# Altium project Farag_32U4_v1.1.PrjPcb
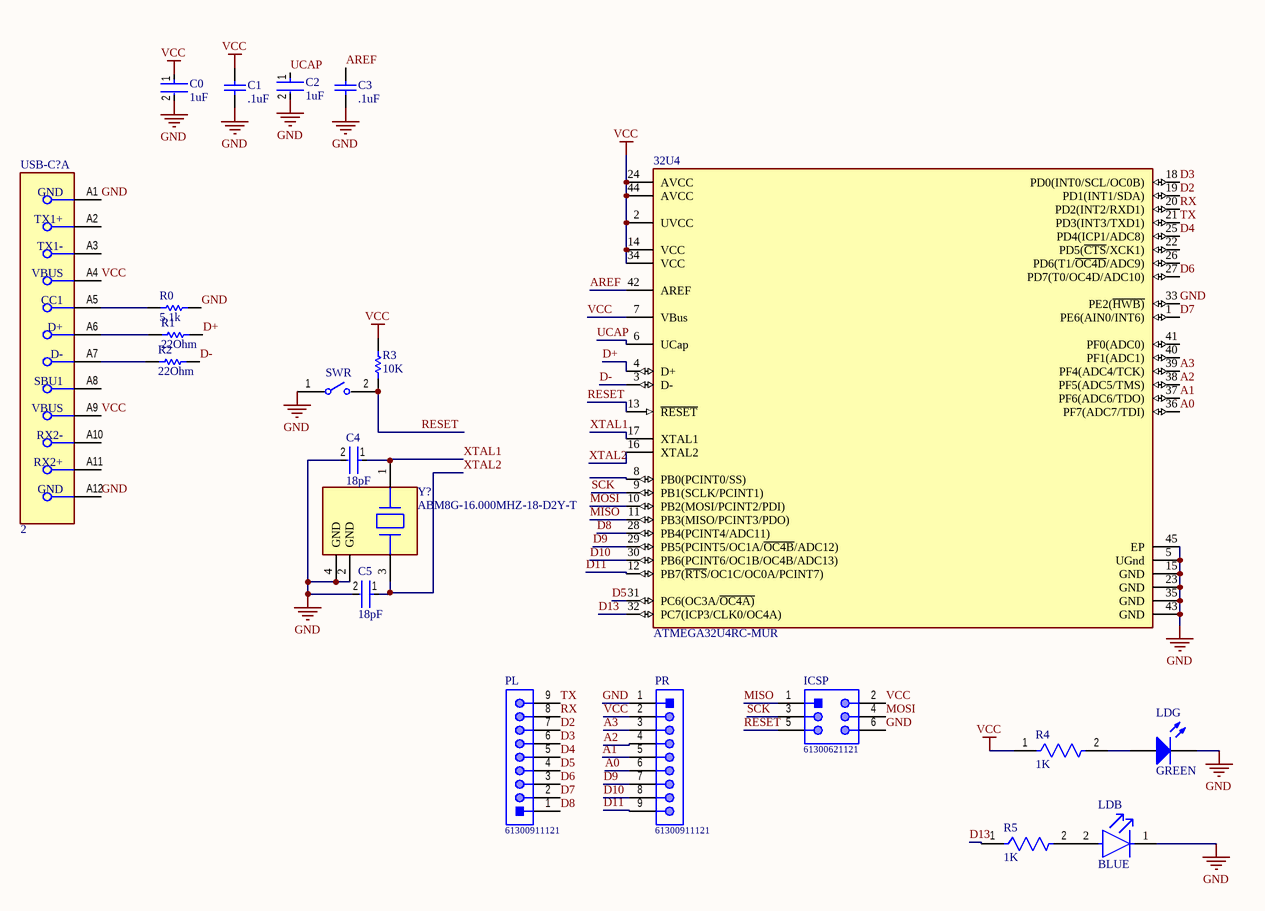
[diagram p0: Sheet1.SchDoc]
CAGE_CODE: ?????; CONTRACT_NUMBER: <CONTRACT NO>; DOC_NO_ASSY_DWG: <ASSY DWG NO>; DOC_NO_BOM: <BOM DOC NO>; DOC_NO_FAB_DWG: <FAB DWG NO>; DOC_NO_SCH_DWG: <SCH DWG NO>; PCB_2_DEC_TOL: +/-.01; PCB_3_DEC_TOL: +/-.010; PCB_ANG_TOL: +/-1/2; PCB_ASSEMBLY_NO: <PCB ASSY NO>; PCB_CHECKER: - -----; PCB_CHECKER_APP_DATE: --/--/----; PCB_DESIGNER: - -----; PCB_DESIGNER_APP_DATE: --/--/----; PCB_DWG_NO: <PCB DWG NO>; PCB_ENGINEER: - -----; PCB_ENGINEER_APP_DATE: --/--/----; PCB_PART_NUMBER: <PCB PN>; PCB_REV: A; SCH_REV: A
1 sheet, 21 parts. Net scope: global (net labels, ports and power ports of the same name join across sheets).
Board file: PCB1.PcbDoc

## Sheet Sheet1.SchDoc
size 431 x 279 mm; SheetNumber: 1; SheetTotal: 1; ENG_APP_DATE: --/--/--; DSN_APP_DATE: --/--/--; CHK_APP_DATE: --/--/--

### Parts
2  2  [FP-1054500101-MFG]  (part A of 3)
32U4  ATMEGA32U4RC-MUR  [FP-44PW-IPC_A]
C0  1uF  [FP-CC0805-EB-MFG]
C1  .1uF  [CAPC2013X145X50LL20T25]
C2  1uF  [FP-CC0805-EB-MFG]
C3  .1uF  [CAPC2013X145X50LL20T25]
C4  18pF  [FP-C0805C-DN-MFG]
C5  18pF  [FP-C0805C-DN-MFG]
ICSP  61300621121  [61300621121]
LDB  BLUE
LDG  GREEN  [0805_A]
PL  61300911121  [61300911121]
PR  61300911121  [61300911121]
R0  5.1k  [RESC2013X60X30NL20T20]
R1  22Ohm  [RESC2013X60X30ML20T20]
R2  22Ohm  [RESC2013X60X30ML20T20]
R3  10K  [RESC2013X60X30LL20T20]
R4  1K  [FP-RNCP0805-MFG]
R5  1K  [FP-RNCP0805-MFG]
SWR  (no value)  [FP-B3U-1000P-MFG]
Y1  ABM8G-16.000MHZ-18-D2Y-T  [FP-ABM8G-MFG]

### Nets
GND: 2.A1(GND) 2.A12(GND) 32U4.5(UGnd) 32U4.15(GND) 32U4.23(GND) 32U4.33(PE2(~{HWB)}) 32U4.35(GND) 32U4.43(GND) 32U4.45(EP) C0.2 C1.2 C2.2 C3.2 C4.2 C5.2 ICSP.6 LDB.1(C) LDG.1(K) PR.1 R0.2 SWR.1 Y1.2(GND) Y1.4(GND)
VCC: 2.A4(VBUS) 2.A9(VBUS) 32U4.2(UVCC) 32U4.7(VBus) 32U4.14(VCC) 32U4.24(AVCC) 32U4.34(VCC) 32U4.44(AVCC) C0.1 C1.1 ICSP.2 PR.2 R3.1 R4.1
A0: 32U4.36(PF7(ADC7/TDI)) PR.6
A1: 32U4.37(PF6(ADC6/TDO)) PR.5
A2: 32U4.38(PF5(ADC5/TMS)) PR.4
A3: 32U4.39(PF4(ADC4/TCK)) PR.3
AREF: 32U4.42(AREF) C3.1
D2: 32U4.19(PD1(INT1/SDA)) PL.7
D3: 32U4.18(PD0(INT0/SCL/OC0B)) PL.6
D4: 32U4.25(PD4(ICP1/ADC8)) PL.5
D5: 32U4.31(PC6(OC3A/~{OC4A)}) PL.4
D6: 32U4.27(PD7(T0/OC4D/ADC10)) PL.3
D7: 32U4.1(PE6(AIN0/INT6)) PL.2
D8: 32U4.28(PB4(PCINT4/ADC11)) PL.1
D9: 32U4.29(PB5(PCINT5/OC1A/~{OC4B}/ADC12)) PR.7
D10: 32U4.30(PB6(PCINT6/OC1B/OC4B/ADC13)) PR.8
D11: 32U4.12(PB7(~{RTS}/OC1C/OC0A/PCINT7)) PR.9
D13: 32U4.32(PC7(ICP3/CLK0/OC4A)) R5.1
D+: 32U4.4(D+) R1.2
D-: 32U4.3(D-) R2.2
MISO: 32U4.11(PB3(MISO/PCINT3/PDO)) ICSP.1
MOSI: 32U4.10(PB2(MOSI/PCINT2/PDI)) ICSP.4
RESET: 32U4.13(~{RESET}) ICSP.5 R3.2 SWR.2
RX: 32U4.20(PD2(INT2/RXD1)) PL.8
SCK: 32U4.9(PB1(SCLK/PCINT1)) ICSP.3
TX: 32U4.21(PD3(INT3/TXD1)) PL.9
UCAP: 32U4.6(UCap) C2.1
XTAL1: 32U4.17(XTAL1) C4.1 Y1.1
XTAL2: 32U4.16(XTAL2) C5.1 Y1.3
Net2_A5: 2.A5(CC1) R0.1
Net2_A6: 2.A6(D+) R1.1
Net2_A7: 2.A7(D-) R2.1
NetLDB_2: LDB.2(A) R5.2
NetLDG_2: LDG.2(A) R4.2

Not connected (* = marked no-connect by the designer): 2 A2(TX1+) A3(TX1-) A8(SBU1) A10(RX2-) A11(RX2+); 32U4 8(PB0(PCINT0/SS)) 22(PD5(~{CTS}/XCK1)) 26(PD6(T1/~{OC4D}/ADC9)) 40(PF1(ADC1)) 41(PF0(ADC0))

### Library data of the parts
2 = CMP-04767-000004-1: CONN RCP USB3.1 TYPEC 24P SMD RA; Manufacturer: Molex; Manufacturer Part Number: 1054500101; Number Of Contacts: 24; Voltage Rating: 30V; Shielding: true; Is Female: yes; Current Rating: 0.25/1.25/5A; Pitch: 0.5mm; Conn Orientation: Right Angle
32U4 = CMP-06276-000241-1: IC MCU 8BIT 32KB FLASH 44VQFN; Core Architecture: AVR; Frequency: 16MHz; Oscillator Type: Internal; Interface: I2C; Peripherals: Brown-out Detect/Reset; Number of I/Os: 26; Packaging: Tape and Reel; Max Operating Temperature: 85°C; Min Operating Temperature: -40°C; Memory Type: FLASH; Case/Package: VQFN; Memory Size: 32KB; RoHS Compliant: Yes
C0 C2 = CMP-03422-000665-2: CAP CER 1UF 6.3V X7R 0805 - CC0805KKX7R5BB105; Tolerance: 10%; Capacitance: 1uF; Weight: 0.000194oz; Width: 0.049inch; Thickness: 0.057inch; Dielectric: X7R; Termination: SMD/SMT; Packaging: Tape and Reel; RoHS Compliant: Yes; Length: 2mm; Halogen Free: Halogen Free; Voltage Rating: 6.3V; Height: 1.25mm; Max Operating Temperature: 125°C; Depth: 1.25mm; Construction: Flat; Case Code (Metric): 2012; Series: CC; Case/Package: 0805; Resistor Type: Ceramic; Case Code (Imperial): 0805; Min Operating Temperature: -55°C; Voltage Rating (DC): 6.3V; Lead Free: Lead Free; Mount: Surface Mount; Radiation Hardening: No
C1 C3 = CMP-1036-04391-2: C0805C104K9RACTU; Manufacturer: Kemet; Part Number: C0805C104K9RACTU
C4 C5 = CMP-1036-01146-3: CAP CER 18PF 50V 10% NP0 0805 - C0805C180K5GACTU; Manufacturer: KEMET; Tolerance: 0.1; Material: Ceramic; Temperature Coefficient: 30ppm/°C; Temperature Characteristic: C0G; Mouser Description: Multilayer Ceramic Capacitors MLCC - SMD/SMT 50volts 18pF C0G 10%; Category: Cap; Automotive: No; Device Class L1: Passive Components; Height: 0.88mm; RoHS: TRUE; Manufacturer Part Number: C0805C180K5GACTU; Octopart: https://octopart.com/c0805c180k5gactu-kemet-6728804; Ipc Land Pattern Name: CAPC200125X78; Voltage Rating: 50 V; ComponentLink2URL: https://content.kemet.com/datasheets/KEM_C1003_C0G_SMD.pdf; ComponentLink2Description: Datasheet; Value: 18 pF; Temperature Range Low: -55°C; Digikey Description: CAP CER 18PF 50V 10% NP0 0805; Lead Free: Yes; Temperature Range High: +125°C; Device Class L2: Capacitors; Device Class L3: Ceramic Capacitors; Temperature: -55°C to +125°C; Capacitance: 18 pF; Package: C0805C-DN
ICSP = CMP-1502-01072-1: THT Vertical Pin Header WR-PHD, Pitch 2.54 mm, Dual Row, 6 pins; Manufacturer: Wurth Elektronik; Contact Resistance: 20mOhm; Withstanding Voltage: 500VAC; Pin Number: 6; Gender: Male; Pitch: 2.54mm; Working Voltage: 250VAC; Rated Current: 3A; Packaging: Bag; Row Number: Dual; Manufacturer URL: http://www.we-online.de; Part Number: 61300621121; Operating Temperature: -40to105degC; Mounting Technology: THT; Package Reference: 61300621121; Datasheet URL: https://katalog.we-online.de/em/datasheet/6130xx21121.pdf; Orientation: Vertical; Publisher: WurthElektronik
LDB = CMP-1426-00008-2: LED BLUE CLEAR 0805 SMD - 150080BS75000; Test Current: 20mA; Dominant Wavelength: 470nm; Forward Voltage: 3.2V; Forward Current: 30mA; Lens Size: 1.25mm; Luminous Intensity: 145mcd; Lens Color: Colorless; Viewing Angle: 140°; Case Code (Imperial): 0805; RoHS Compliant: Yes; Mount: Surface Mount; Lens Transparency: Clear; Max Operating Temperature: 85°C; Package Quantity: 1; Width: 1.25mm; Case Code (Metric): 2012; Length: 2mm; Lens Style: Clear; Height: 0.8mm; Color: Blue; Lead Free: Lead Free; Wavelength: 470nm; Case/Package: 0805; Series: WL-SMCW; Min Operating Temperature: -40°C; Packaging: Cut Tape
LDG = CMP-1426-00007-1: SMD mono-color Chip LED, WL-SMCW, Green - 150080GS75000; Manufacturer: Wuerth Elektronik; PackageReference: 0805_A; Color: Green; PartNumber: 150080GS75000; ComponentLink2URL: http://katalog.we-online.com/led/datasheet/150080GS75000.pdf; ComponentLink1URL: http://www.we-online.com; ComponentLink1Description: Manufacturer URL; ComponentLink2Description: Datasheet
PL PR = CMP-1502-01080-1: THT Vertical Pin Header WR-PHD, Pitch 2.54 mm, Single Row, 9 pins; Manufacturer: Wurth Elektronik; Pitch: 2.54mm; Gender: Male; Working Voltage: 250VAC; Contact Resistance: 20mOhm; Withstanding Voltage: 500VAC; Pin Number: 9; Rated Current: 3A; Package Reference: 61300911121; Part Number: 61300911121; Mounting Technology: THT; Publisher: WurthElektronik; Manufacturer URL: http://www.we-online.de; Orientation: Vertical; Datasheet URL: https://katalog.we-online.de/em/datasheet/6130xx11121.pdf; Operating Temperature: -40to105degC; Row Number: Single; Packaging: Bag
R0 = CMP-2001-01842-1: RK73B2ATTD512J; Manufacturer: KOA Speer; Part Number: RK73B2ATTD512J
R1 R2 = CMP-2001-04578-1: RK73B2ATTD220J; Manufacturer: KOA Speer; Part Number: RK73B2ATTD220J
R3 = CMP-2001-01993-1: RK73H2ATTD1002F; Manufacturer: KOA Speer; Part Number: RK73H2ATTD1002F
R4 R5 = CMP-26527-001902-1: 1kΩ ±1% 0.25W 0805 High Power Anti-Sulfur Thin Film Chip Resistor - RNCP0805FTD1K00; Resistance: 1kR; Power Rating: 250mW; Temperature Coefficient: 100ppm/°C; Series: RNCP; RoHS Compliant: Yes; Case Code (Metric): 2012; Length: 0.079inch; Case/Package: 0805; Max Power Dissipation: 250mW; Height: 0.024inch; Size Code: 0805; Max Operating Temperature: 155°C; Tolerance: 1%; Min Operating Temperature: -55°C; Width: 0.049inch; Case Code (Imperial): 0805; Packaging: Tape and Reel; Mount: Surface Mount; Features: Moisture Resistant; Lead Free: Lead Free; Resistor Type: Thin Film; Number of Terminations: 2
SWR = CMP-2100-03586-2: SWITCH TACTILE SPST-NO 0.05A 12V - B3U-1000P; Contact Resistance: 100mR; Operating Force: 1.5N; Max Current Rating: 50mA; Switch Travel: 0.15mm; Actuator Type: Standard; Mechanical Life: 200000Cycles; Ratings: Dust Proof; Illumination Type: Non-Illuminated; Throw Configuration: SPST; Actuator Length: 0.4mm; Switch Function: Off-Mom; Height: 1.2mm; Width: 3mm; Weight: 0.000776oz; Contact Material: Silver; Max Voltage Rating (DC): 12V; Insulation Resistance: 100MR; Lead Free: Lead Free; Current Rating: 50mA; Termination: SMD/SMT; Length: 4mm; Voltage Rating (DC): 12V; Contact Current Rating: 50mA; Orientation: Straight; Depth: 2.5mm; Max Operating Temperature: 70°C; Packaging: Tape and Reel; Min Operating Temperature: -25°C; Package Quantity: 1; Mount: Surface Mount; Electrical Life: 200000Cycles
Y1 = CMP-27762-006537-2: Crystal 16MHz ±20ppm (Tol) ±30ppm (Stability) 18pF FUND 80Ω 4-Pin SMD T/R; Series Resistance: 80R